# EAGLE design placa1 (EAGLE 7.4.0)
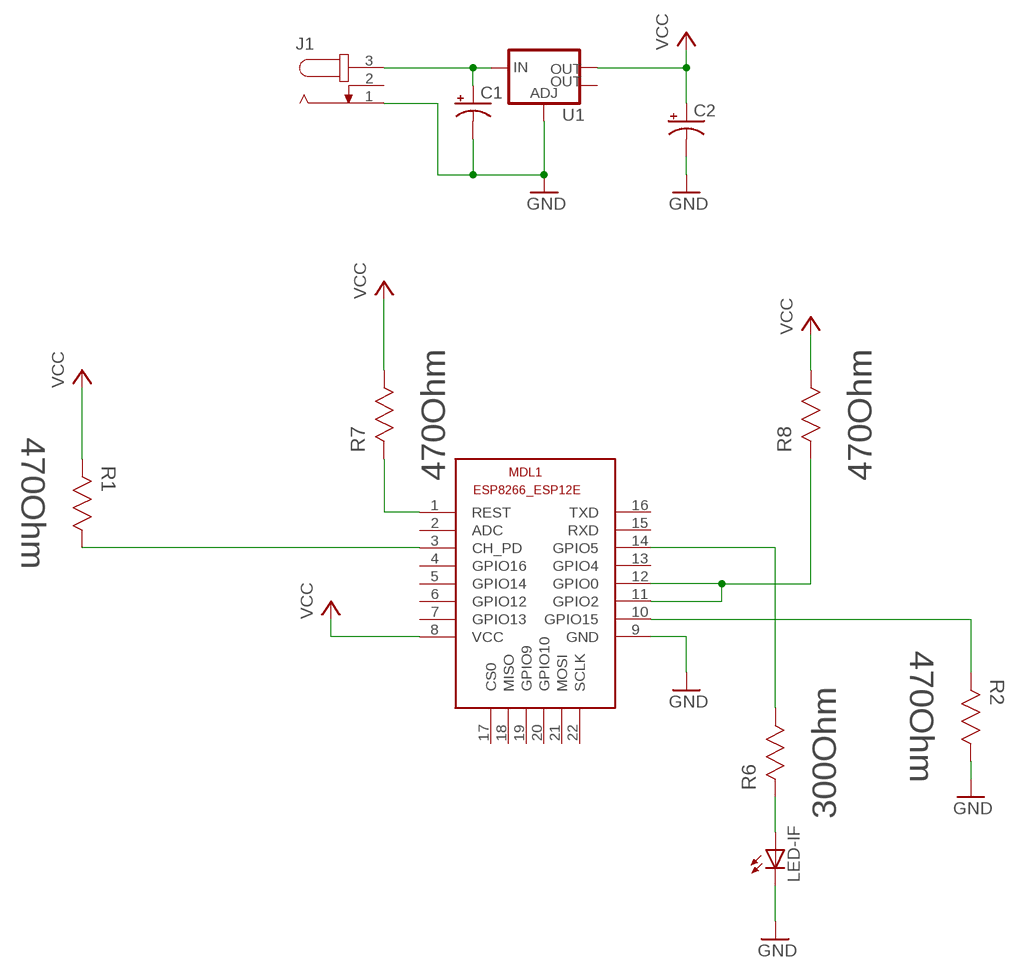
[diagram p0: schematic, sheet 1]

## Parts
C1  CAP_POLC  [PANASONIC_C]
C2  CAP_POLC  [PANASONIC_C]
J1  JACK-PLUG0  [SPC4077]
LED-IF  LED5MM  [LED5MM]
MDL1  ESP8266-12EESP8266-ESP12E  [ESP8266-ESP12E]
R1  470Ohm  MCPWR05FTEW4700  [RESC2013X65N]
R2  470Ohm  MCPWR05FTEW4700  [RESC2013X65N]
R6  300Ohm  MCPWR05FTEW3000  [RESC2013X65N]
R7  470Ohm  MCPWR05FTEW4700  [RESC2013X65N]
R8  470Ohm  MCPWR05FTEW4700  [RESC2013X65N]
U1  V_REG_LM1117SOT223  [SOT223]

## Nets
GND: C1.- C2.- J1.1 LED-IF.K(C) MDL1.9(GND) R2.1(R1) U1.1(ADJ)
N$1: MDL1.3(CH_PD) R1.1(R1)
N$2: MDL1.10(GPIO15) R2.2(R2)
N$3: MDL1.11(GPIO2) MDL1.12(GPIO0) R8.2(R2)
N$4: MDL1.1(REST) R7.2(R2)
N$5: MDL1.14(GPIO5) R6.1(R1)
N$6: C1.+ J1.3 U1.3(IN)
N$7: LED-IF.A R6.2(R2)
VCC: C2.+ MDL1.8(VCC) R1.2(R2) R7.1(R1) R8.1(R1) U1.2(OUT)
Unconnected: J1.2 MDL1.2(ADC) MDL1.4(GPIO16) MDL1.5(GPIO14) MDL1.6(GPIO12) MDL1.7(GPIO13) MDL1.13(GPIO4) MDL1.15(RXD) MDL1.16(TXD) MDL1.17(CS0) MDL1.18(MISO) MDL1.19(GPIO9) MDL1.20(GPIO10) MDL1.21(MOSI) MDL1.22(SCLK) U1.4(OUT)

## Library data of the parts
C1 C2 = SparkFun-Capacitors:CAP_POL: Capacitor Polarized These are standard SMD and PTH capacitors. Normally 10uF, 47uF, and 100uF in electrolytic and tantalum varieties. Always verify the external diameter of the through hole cap, it varies with capacity, voltage, and manufacturer. The EIA devices should be standard.
J1 = con-jack:JACK-PLUG: DC POWER JACK Power Jack, DC, Right Angle, Through Hole, Rated 5A at 16VDC, PC Terminals Distributor: Farnell (www.Farnell.de) Drawing: 84N1161.pdf / 84N1162.pdf Manufacturer: SPC Technology (www.spctechnology.com) Type: SPC4077 / SPC 4078; OC_FARNELL: unknown; OC_NEWARK: unknown
LED-IF = adafruit:LED: LED OSRAM: - CHIPLED LG R971, LG N971, LY N971, LG Q971, LY Q971, LO R971, LY R971 LH N974, LH R974 LS Q976, LO Q976, LY Q976 LO Q996 - Hyper CHIPLED LW Q18S LB Q993, LB Q99A, LB R99A - SideLED LS A670, LO A670, LY A670, LG A670, LP A670 LB A673, LV A673, LT A673, LW A673 LH A674 LY A675 LS A676, LA A676, LO A676, LY A676, LW A676 LS A679, LY A679, LG A679 - Hyper Micro SIDELED® LS Y876, LA Y876, LO Y876, LY Y876 LT Y87S - SmartLED LW L88C, LW L88S LB L89C, LB L89S, LG L890 LS L89K, LO L89K, LY L89K LS L896, LA L896, LO L896, LY L896 - TOPLED LS T670, LO T670, LY T670, LG T670, LP T670 LSG T670, LSP T670, LSY T670, LOP T670, LYG T670 LG T671, LOG T671, LSG T671 LB T673, LV T673, LT T673, LW T673 LH T674 LS T676, LA T676, LO T676, LY T676, LB T676, LH T676, LSB T676, LW T676 LB T67C, LV T67C, LT T67C, LS T67K, LO T67K, LY T67K, LW E67C LS E67B, LA E67B, LO E67B, LY E67B, LB E67C, LV E67C, LT E67C LW T67C LS T679, LY T679, LG T679 LS T770, LO T770, LY T770, LG T770, LP T770 LB T773, LV T773, LT T773, LW T773 LH T774 LS E675, LA E675, LY E675, LS T675 LS T776, LA T776, LO T776, LY T776, LB T776 LHGB T686 LT T68C, LB T68C - Hyper Mini TOPLED® LB M676 - Mini TOPLED Santana® LG M470 LS M47K, LO M47K, LY M47K Source: http://www.osram.convergy.de/
MDL1 = ESP8266-ESP12E:ESP8266-12E: ESP8266-12E with additional I/O and GPIO04/05 corrected The author cannot warrant that this library is free from error or will meet your specific requirements. Created by PuceBaboon.com. Komagane, Nagano, JAPAN
R1 R2 R7 R8 = Multicomp_By_element14_Batch_1:MCPWR05FTEW4700: RESISTOR, 0805; MPN: MCPWR05FTEW4700; OC_FARNELL: 1887272; OC_NEWARK: 43T5491; POWERRATING: 125mW; SUPPLIER: MULTICOMP; TOLERANCE: ± 1%
R6 = Multicomp_By_element14_Batch_1:MCPWR05FTEW3000: RESISTOR, 0805; MPN: MCPWR05FTEW3000; OC_FARNELL: 1887265; OC_NEWARK: 43T5466; POWERRATING: 125mW; SUPPLIER: MULTICOMP; TOLERANCE: ± 1%
U1 = SparkFun-PowerIC:V_REG_LM1117: Voltage Regulator LM1117 Standard adjustable voltage regulator but in SMD form. Spark Fun Electronics SKU : COM-00595; PROD_ID: VREG-08170

## Board
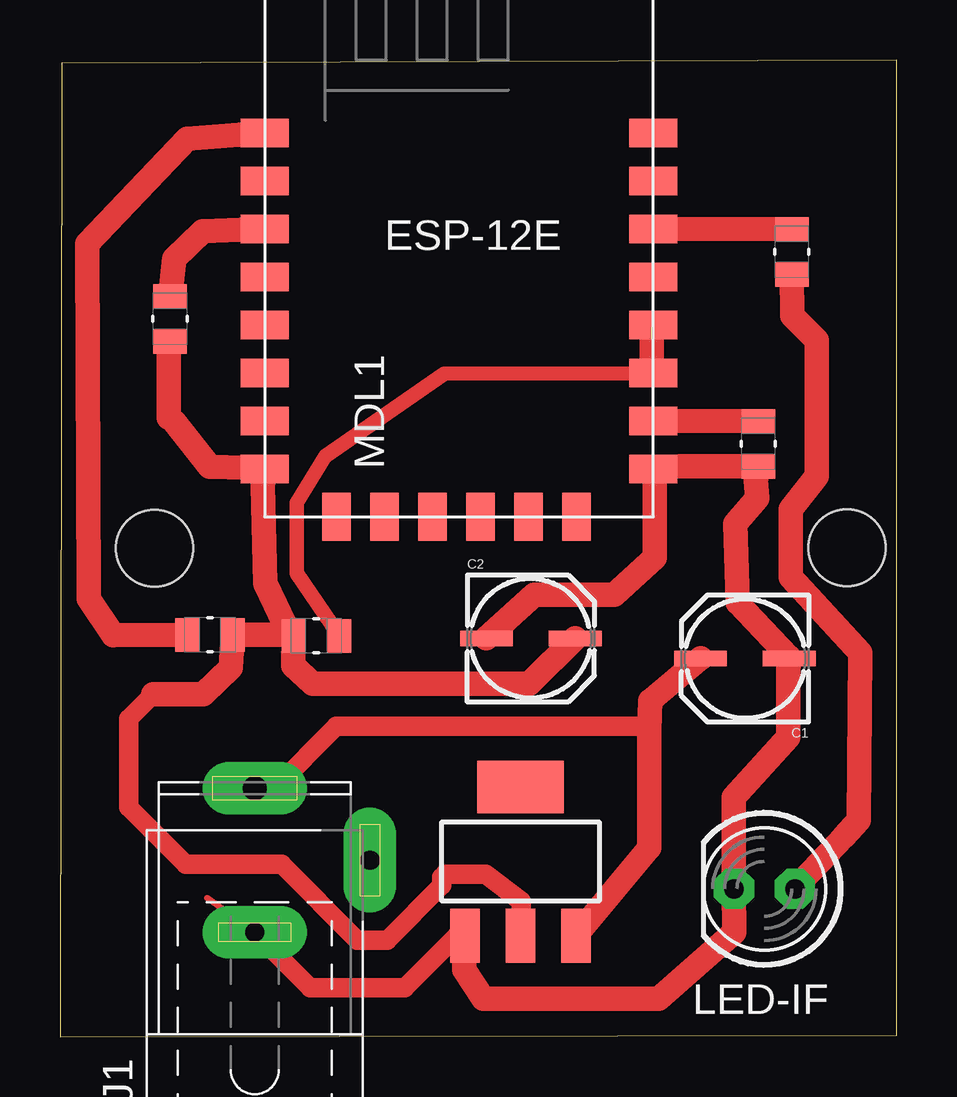
[diagram p1: board, top side]

Size 34.86 x 40.69 mm. Coordinates in mm from the lower left corner, seen from the top.
Outline: 0,0 34.86,0.06 34.86,40.69 0.06,40.55 0,0
Copper layers (1*16): Top 0.035mm / dielectric 1.5mm / Bottom 0.035mm
Design rules "default": minimum track width 10mil, minimum drill 24mil, track to track 8mil, track to pad 8mil, pad to pad 8mil, via to via 8mil, smd to smd 8mil, copper to edge 40mil, drill to drill 8mil, minimum pad ring 10mil, minimum via ring 8mil, stop-mask expansion 4mil, vias tented up to drill 0mil, thermal gap 10mil
Holes 3.2 mm at 3.94,20.35 32.79,20.37

### Footprints (pad centres in the part's own frame; a part is rotated, then mirrored left to right if it is on the bottom)
PANASONIC_C = smd 2.2 x 0.65: + 1.9,-0.2; - -1.8,-0.2
SPC4077 = drill 0.8 pad 2.184 long: 1 -3,0; 2 0,-4.8 | drill 1 pad 2.184 long: 3 3,0
LED5MM = drill 0.813 pad 1.676 octagon: A -1.27,0; K 1.27,0
ESP8266-ESP12E = smd 2 x 1.2: 1 0,16; 2 0,14; 3 0,12; 4 0,10; 5 0,8; 6 0,6; 7 0,4; 8 0,2; 9 16.2,2; 10 16.2,4; 11 16.2,6; 12 16.2,8; 13 16.2,10; 14 16.2,12; 15 16.2,14; 16 16.2,16 | smd 1.2 x 2: 17 11,0; 18 3,0; 19 5,0; 20 13,0; 21 7,0; 22 9,0
RESC2013X65N = smd 1.016 x 1.397: 1 -0.94,0; 2 0.94,0
SOT223 = smd 1.219 x 2.235: 1 -2.311,-3.099; 2 0,-3.099; 3 2.311,-3.099 | smd 3.6 x 2.2: 4 0,3.099

### Placement (x,y rotation side)
C1  28.59,15.56 180 top
C2  19.57,16.79 0 top
J1  8.12,7.35 90 top
LED-IF  29.35,6.16 180 top
MDL1  8.52,21.65 0 top
R1  4.58,29.91 270 top
R2  29.1,24.7 90 top
R6  30.49,32.7 270 top
R7  6.25,16.74 180 top
R8  10.68,16.7 0 top
U1  19.19,7.3 0 top

### Tracks (layer width: path | path; a pad name or v marks a point on that pad's centre or on a via)
GND
  Top 0.254: 6.13,5.78 J1.1 | 28.99,23.84 R2.1 29.22,23.61 | 24.88,23.84 MDL1.9 | 30.37,15.84 C1.- 30.37,15.61 | 16.88,4.18 U1.1 | 28.08,6.01 LED-IF.K
  Top 0.61: 25.82,23.76 MDL1.9
  Top 0.813: U1.1 16.52,4.2 14.36,2.04 10.42,2.04 J1.1
  Top 1.016: U1.1 16.84,2.79 17.64,1.59 24.96,1.59 28.09,4.36 LED-IF.K 28.08,9.98 30.34,12.47 30.34,15.25 C1.- | 25.82,23.76 R2.1 28.98,23.18 29.04,22.44 28.13,21.36 28.24,18.08 30.37,15.84 | C2.- 19.76,18.42 23.1,18.42 24.79,19.95 24.79,23.01 MDL1.9
N$1
  Top 0.406: 8.46,33.59 MDL1.3
  Top 1.016: R1.1 4.76,32.41 5.94,33.55 MDL1.3
N$2
  Top 0.254: 28.99,25.67 R2.2 | 24.88,25.67 MDL1.10
  Top 1.016: MDL1.10 R2.2
N$3  (1 unrouted)
  Top 0.254: 11.62,16.75 R8.2 | 22.87,27.62 23.89,27.64 MDL1.11 24.65,27.72 | 24.65,29.55 MDL1.12
  Top 0.61: 11.62,16.75 9.87,19.32 9.87,22.24 11.06,24.19 16.01,27.62 23.89,27.64
  Top 1.016: 24.65,27.72 24.65,29.07
N$4
  Top 0.254: 8.65,37.78 MDL1.1
  Top 1.016: R7.2 2.21,16.73 1.19,18.25 1.13,33.05 5.3,37.41 MDL1.1
N$5
  Top 0.254: 30.37,33.67 R6.1 | 24.88,33.67 MDL1.14
  Top 1.016: 24.88,33.67 R6.1
N$6
  Top 0.254: 26.48,15.61 C1.+ | 21.68,4.41 U1.3 21.45,4.41
  Top 0.813: J1.3 8.94,10.35 11.52,12.93 24.38,12.93 24.55,12.76
  Top 1.016: 21.68,4.41 24.55,7.86 24.55,12.76 24.6,14 C1.+
N$7
  Top 0.254: 30.59,31.61 R6.2
  Top 1.016: LED-IF.A 32.66,8.33 33.29,9.02 33.34,15.99 30.45,19.15 30.45,21.98 31.53,23.36 31.53,29.02 30.52,30.04 R6.2
VCC
  Top 0.254: 9.56,16.75 R8.1 | 8.65,23.61 MDL1.8
  Top 0.406: 8.49,23.69 MDL1.8
  Top 0.61: 9.56,16.75 9.69,16.75 R8.1
  Top 0.813: U1.2 19.21,5.64 17.74,6.77 16.04,6.77 15.91,6.64 15.91,6.3 13.64,4.03 12.4,4.03 9.25,7.18 5.23,7.18 2.86,9.55 2.86,13.25 3.89,14.27
  Top 1.016: 8.49,23.69 6.24,23.75 4.76,25.62 4.53,25.78 4.53,28.45 R1.2 | MDL1.8 8.46,22.96 8.55,18.9 9.56,16.75 R7.1 7.11,15.38 5.97,14.27 3.89,14.27 | R8.1 9.73,15.46 10.53,14.71 19.55,14.71 C2.+